# EAGLE design capelet_rf (EAGLE 9.4.2)
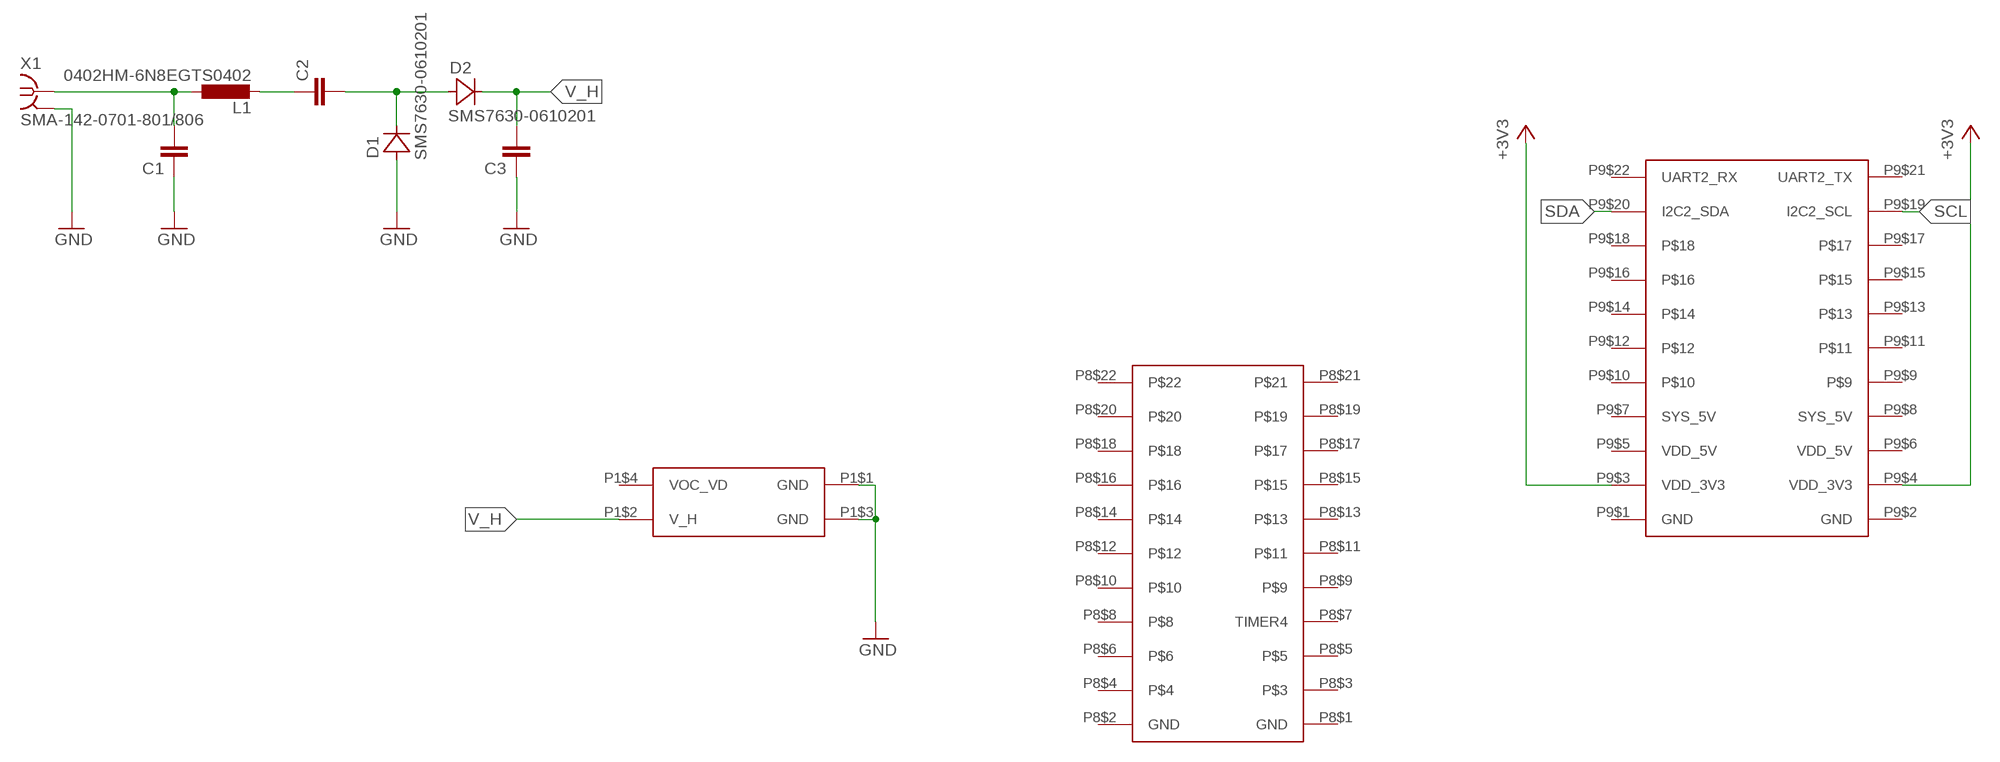
[diagram p0: schematic, sheet 1]

## Parts
C1  C_SMD0402  [CAPC1005X55]
C2  C_SMD0402  [CAPC1005X55]
C3  C_SMD0402  [CAPC1005X55]
D1  SMS7630-0610201  [DIOC0502X27N]
D2  SMS7630-0610201  [DIOC0502X27N]
L1  0402HM-6N8EGTS0402  [INDC1004X60N]
X1  SMA-142-0701-801/806  [J502-ND-142-0701-801/806]
Y1  SHPRD_CPLT_H  [SHPRD_CPLT_H]

## Nets
+3V3: Y1.P9$3(VDD_3V3) Y1.P9$4(VDD_3V3)
GND: C1.1 C3.1 D1.1(A) X1.G@1 X1.G@2 X1.G@3 X1.G@4 Y1.P1$1(GND) Y1.P1$3(GND)
N$1: C2.2 D1.2(C) D2.1(A)
N$3: C1.2 L1.1 X1.1
N$4: C2.1 L1.2
SCL: Y1.P9$19(I2C2_SCL)
SDA: Y1.P9$20(I2C2_SDA)
V_H: C3.2 D2.2(C) Y1.P1$2(V_H)
Unconnected: Y1.P1$4(VOC_VD) Y1.P8$3 Y1.P8$4 Y1.P8$5 Y1.P8$6 Y1.P8$7(TIMER4) Y1.P8$8 Y1.P8$9 Y1.P8$10 Y1.P8$11 Y1.P8$12 Y1.P8$13 Y1.P8$14 Y1.P8$15 Y1.P8$16 Y1.P8$17 Y1.P8$18 Y1.P8$19 Y1.P8$20 Y1.P8$21 Y1.P8$22 Y1.P9$9 Y1.P9$10 Y1.P9$11 Y1.P9$12 Y1.P9$13 Y1.P9$14 Y1.P9$15 Y1.P9$16 Y1.P9$17 Y1.P9$18 Y1.P9$21(UART2_TX) Y1.P9$22(UART2_RX)

## Power pins joined to a net without a drawn wire
GND: Y1.P8$1(GND) Y1.P8$2(GND) Y1.P9$1(GND) Y1.P9$2(GND)
SYS_5V: Y1.P9$7(SYS_5V) Y1.P9$8(SYS_5V)
VDD_5V: Y1.P9$5(VDD_5V) Y1.P9$6(VDD_5V)

## Library data of the parts
C1-C3 = shepherd:C_SMD
D1 D2 = shepherd:SMS7630-061
L1 = shepherd:0402HM-6N8EGTS
X1 = con-coax:SMA-: SMA 50 Ohm End Launch Jack Receptacle - Round Contact Johnson Components Source: www.johnsoncomponents.com .. J502-ND.pdf; MF: JOHNSON COMPONENTS; MPN: 142-0701-801; OC_FARNELL: 1608592; OC_NEWARK: 90F2624
Y1 = shepherd:SHPRD_CPLT_H

## Board
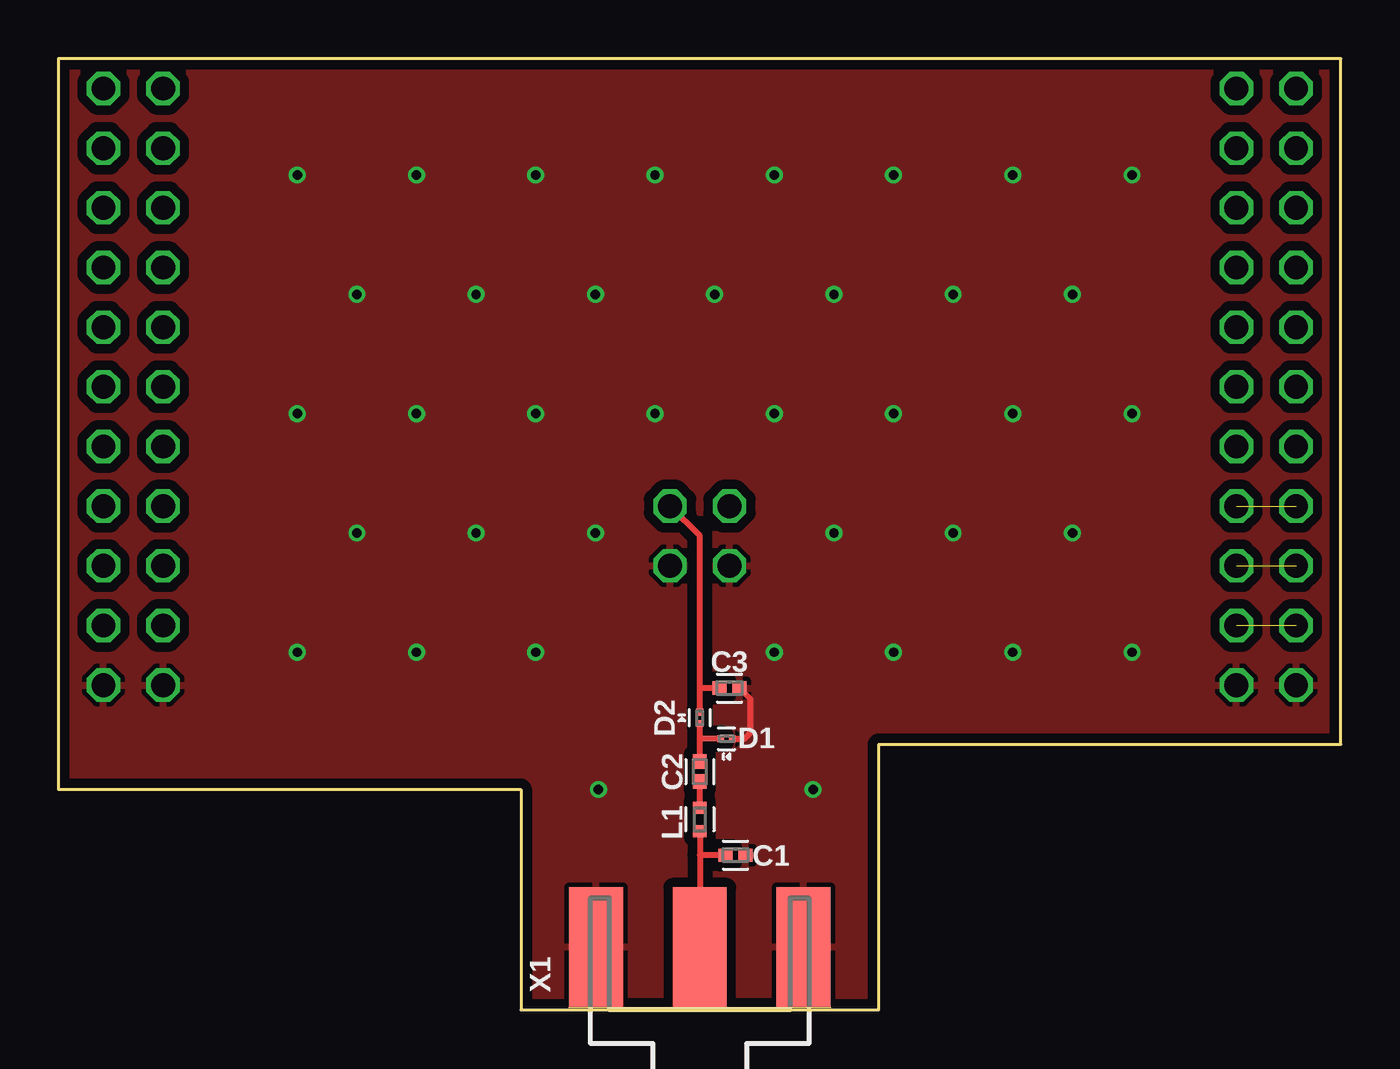
[diagram p1: board, top side]
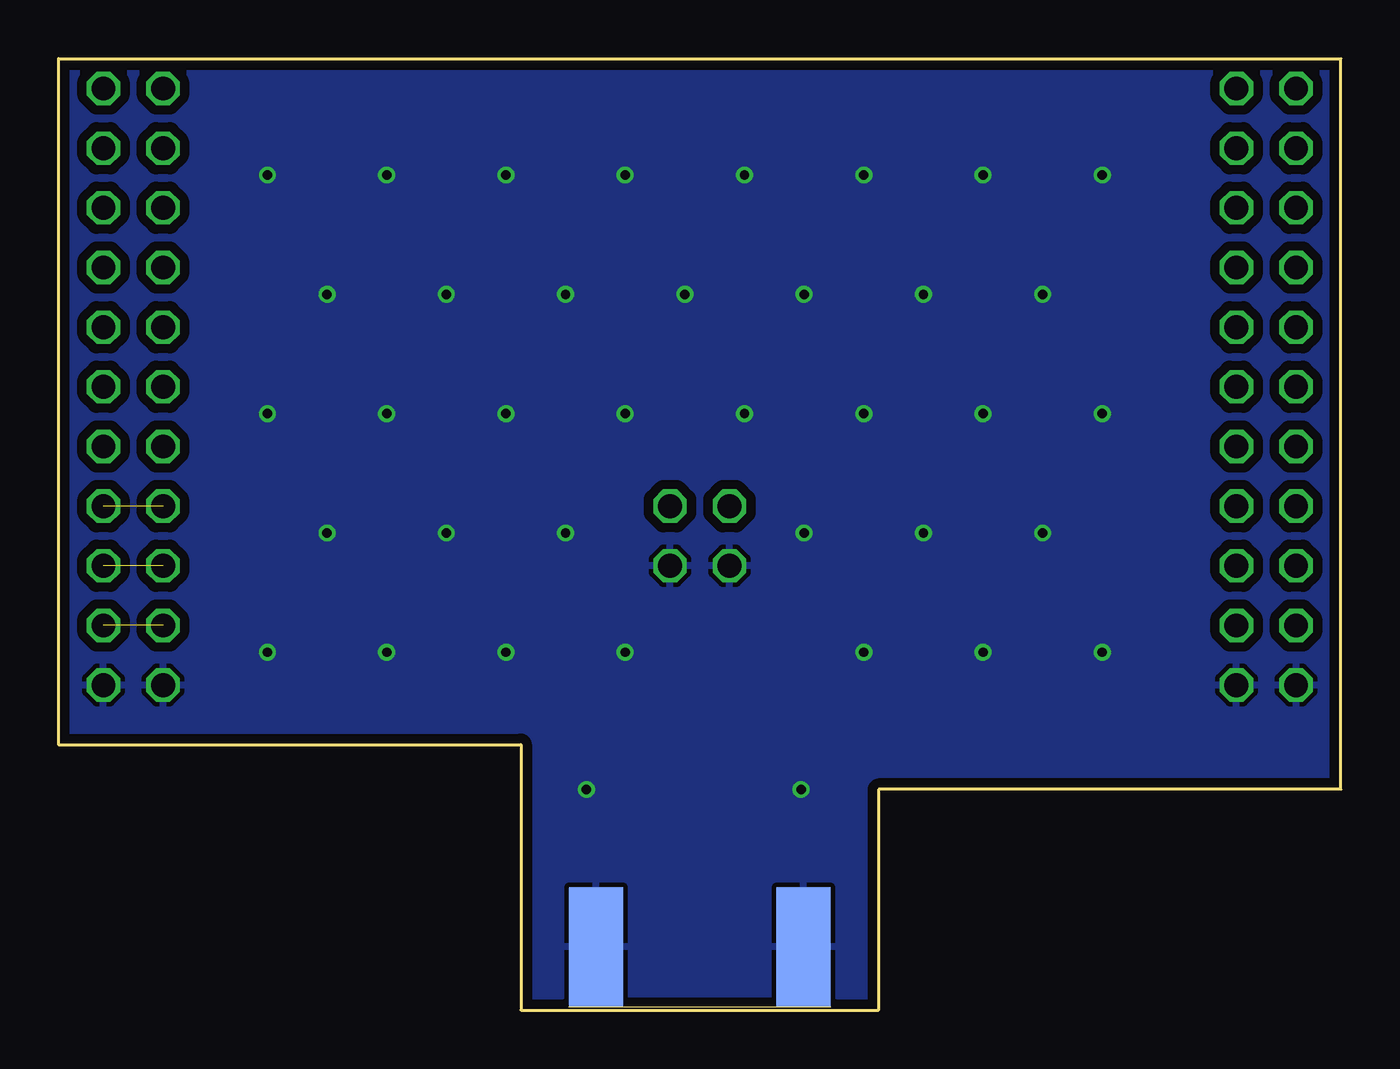
[diagram p2: board, bottom side, seen from below]

Size 54.61 x 40.51 mm. Coordinates in mm from the lower left corner, seen from the top.
Copper layers (1*16): Top 0.035mm / dielectric 1.5mm / Bottom 0.035mm
Design rules "PCB-POOL HighSpec *": minimum track width 0.125mm, minimum drill 0.2mm, track to track 0.125mm, track to pad 0.125mm, pad to pad 0.125mm, via to via 0.125mm, smd to smd 0.125mm, copper to edge 0.3mm, drill to drill 0.2mm, minimum pad ring 0.2mm, minimum via ring 0.125mm, stop-mask expansion 0.075mm, vias tented up to drill 20mil, thermal gap 0.2mm

### Footprints (pad centres in the part's own frame; a part is rotated, then mirrored left to right if it is on the bottom)
CAPC1005X55 = smd 0.608 x 0.562: 1 -0.427,0; 2 0.427,0
DIOC0502X27N = smd 0.28 x 0.3: 1 -0.24,0; 2 0.24,0
INDC1004X60N = smd 0.512 x 0.572: 1 -0.5,0; 2 0.5,0
J502-ND-142-0701-801/806 = smd 5.08 x 2.286: 1 2.565,0; G@1 2.565,4.42; G@2 2.565,-4.42 | smd 5.08 x 2.286 bottom: G@3 2.565,4.42; G@4 2.565,-4.42
SHPRD_CPLT_H = drill 1.016 octagon: P1$1 26.67,24.13; P1$2 26.67,26.67; P1$3 29.21,24.13; P1$4 29.21,26.67; P8$1 5.08,19.05; P8$2 2.54,19.05; P8$3 5.08,21.59; P8$4 2.54,21.59; P8$5 5.08,24.13; P8$6 2.54,24.13; P8$7 5.08,26.67; P8$8 2.54,26.67; P8$9 5.08,29.21; P8$10 2.54,29.21; P8$11 5.08,31.75; P8$12 2.54,31.75; P8$13 5.08,34.29; P8$14 2.54,34.29; P8$15 5.08,36.83; P8$16 2.54,36.83; P8$17 5.08,39.37; P8$18 2.54,39.37; P8$19 5.08,41.91; P8$20 2.54,41.91; P8$21 5.08,44.45; P8$22 2.54,44.45; P9$1 53.34,19.05; P9$2 50.8,19.05; P9$3 53.34,21.59; P9$4 50.8,21.59; P9$5 53.34,24.13; P9$6 50.8,24.13; P9$7 53.34,26.67; P9$8 50.8,26.67; P9$9 53.34,29.21; P9$10 50.8,29.21; P9$11 53.34,31.75; P9$12 50.8,31.75; P9$13 53.34,34.29; P9$14 50.8,34.29; P9$15 53.34,36.83; P9$16 50.8,36.83; P9$17 53.34,39.37; P9$18 50.8,39.37; P9$19 53.34,41.91; P9$20 50.8,41.91; P9$21 53.34,44.45; P9$22 50.8,44.45

### Placement (x,y rotation side)
C1  28.83,6.6 180 top
C2  27.3,10.16 90 top
C3  28.57,13.72 180 top
D1  28.45,11.56 180 top
D2  27.3,12.45 90 top
L1  27.3,8.13 90 top
X1  27.3,0.13 90 top
Y1  -0.64,-5.21 0 top

### Tracks (layer width: path | path; a pad name or v marks a point on that pad's centre or on a via)
+3V3  (1 unrouted)
GND  (via drill 0.4)
  Top 0.254: C3.1 29.46,13.25 29.46,11.81 29.21,11.56 D1.1
  other vias: 10.16,35.56 15.24,35.56 20.32,35.56 25.4,35.56 30.48,35.56 35.56,35.56 40.64,35.56 45.72,35.56 12.7,30.48 17.78,30.48 22.86,30.48 27.94,30.48 33.02,30.48 38.1,30.48 43.18,30.48 10.16,25.4 15.24,25.4 20.32,25.4 25.4,25.4 30.48,25.4 35.56,25.4 40.64,25.4 45.72,25.4 12.7,20.32 17.78,20.32 22.86,20.32 33.02,20.32 38.1,20.32 43.18,20.32 10.16,15.24 15.24,15.24 20.32,15.24 30.48,15.24 35.56,15.24 40.64,15.24 45.72,15.24 32.13,9.4 22.99,9.4
  pour Top (isolate 0.406): 0,40.51 54.61,40.51 54.61,0 0,0
  pour Bottom (isolate 0.406): 0,40.51 54.61,40.51 54.61,0 0,0
N$1
  Top 0.254: C2.2 27.3,11.56 | 27.3,11.56 D2.1 | D1.2 27.3,11.56
N$3
  Top 0.254: C1.2 27.3,6.6 | L1.1 27.3,6.6 | 27.3,6.6 X1.1
N$4
  Top 0.254: L1.2 C2.1
SYS_5V  (1 unrouted)
V_H
  Top 0.254: D2.2 27.3,13.72 | C3.2 27.3,13.72 | Y1.P1$2 27.3,20.19 27.3,13.72
VDD_5V  (1 unrouted)

### Text on the board
tStop: SHEPHERD v1.4 CAPELET RF